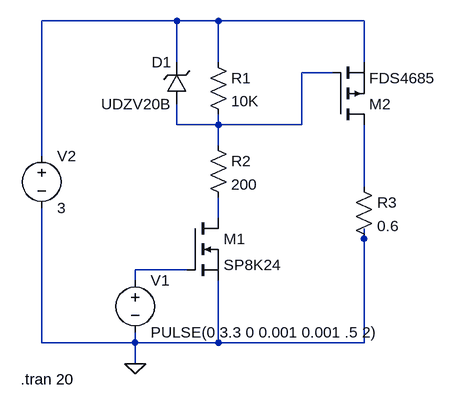
[diagram p0: schematic zkratovani_bocniku.asc]
zkratovani_bocniku.asc, the LTspice schematic file:
Version 4
SHEET 1 880 680
WIRE 80 48 -128 48
WIRE 144 48 80 48
WIRE 368 48 144 48
WIRE 80 112 80 48
WIRE 144 112 144 48
WIRE 368 112 368 48
WIRE 320 128 272 128
WIRE 80 208 80 176
WIRE 144 208 144 192
WIRE 144 208 80 208
WIRE 272 208 272 128
WIRE 272 208 144 208
WIRE 144 240 144 208
WIRE -128 256 -128 48
WIRE 368 304 368 208
WIRE 144 352 144 320
WIRE 368 384 368 368
WIRE 96 432 16 432
WIRE 16 448 16 432
WIRE -128 544 -128 336
WIRE 16 544 16 528
WIRE 16 544 -128 544
WIRE 144 544 144 448
WIRE 144 544 16 544
WIRE 368 544 368 384
WIRE 368 544 144 544
WIRE 16 576 16 544
FLAG 16 576 0
SYMBOL res 128 96 R0
SYMATTR InstName R1
SYMATTR Value 10K
SYMBOL res 128 224 R0
SYMATTR InstName R2
SYMATTR Value 200
SYMBOL nmos 96 352 R0
SYMATTR InstName M1
SYMATTR Value SP8K24
SYMBOL pmos 320 208 M180
SYMATTR InstName M2
SYMATTR Value FDS4685
SYMBOL voltage -128 240 R0
WINDOW 123 0 0 Left 0
WINDOW 39 0 0 Left 0
SYMATTR InstName V2
SYMATTR Value 3
SYMBOL res 352 288 R0
SYMATTR InstName R3
SYMATTR Value 0.6
SYMBOL voltage 16 432 R0
WINDOW 123 0 0 Left 0
WINDOW 39 0 0 Left 0
SYMATTR InstName V1
SYMATTR Value PULSE(0 3.3 0 0.001 0.001 .5 2)
SYMBOL zener 96 176 R180
WINDOW 0 24 64 Left 2
WINDOW 3 24 0 Left 2
SYMATTR InstName D1
SYMATTR Value UDZV20B
TEXT -160 600 Left 2 !.tran 20

The netlist it stands for:
* zkratovani_bocniku.asc
R1 N001 N002 10K
R2 N002 N004 200
M1 N004 N005 0 0 SP8K24
M2 N003 N002 N001 N001 FDS4685
V2 N001 0 3
R3 N003 0 0.6
V1 N005 0 PULSE(0 3.3 0 0.001 0.001 .5 2)
D1 N002 N001 UDZV20B
.model D D
.lib standard.dio
.model NMOS NMOS
.model PMOS PMOS
.lib standard.mos
.tran 20
.backanno
.end